# Altium schematic sheet ADS1299DRV.SchDoc
size A2; SheetNumber: 7; SheetTotal: 7
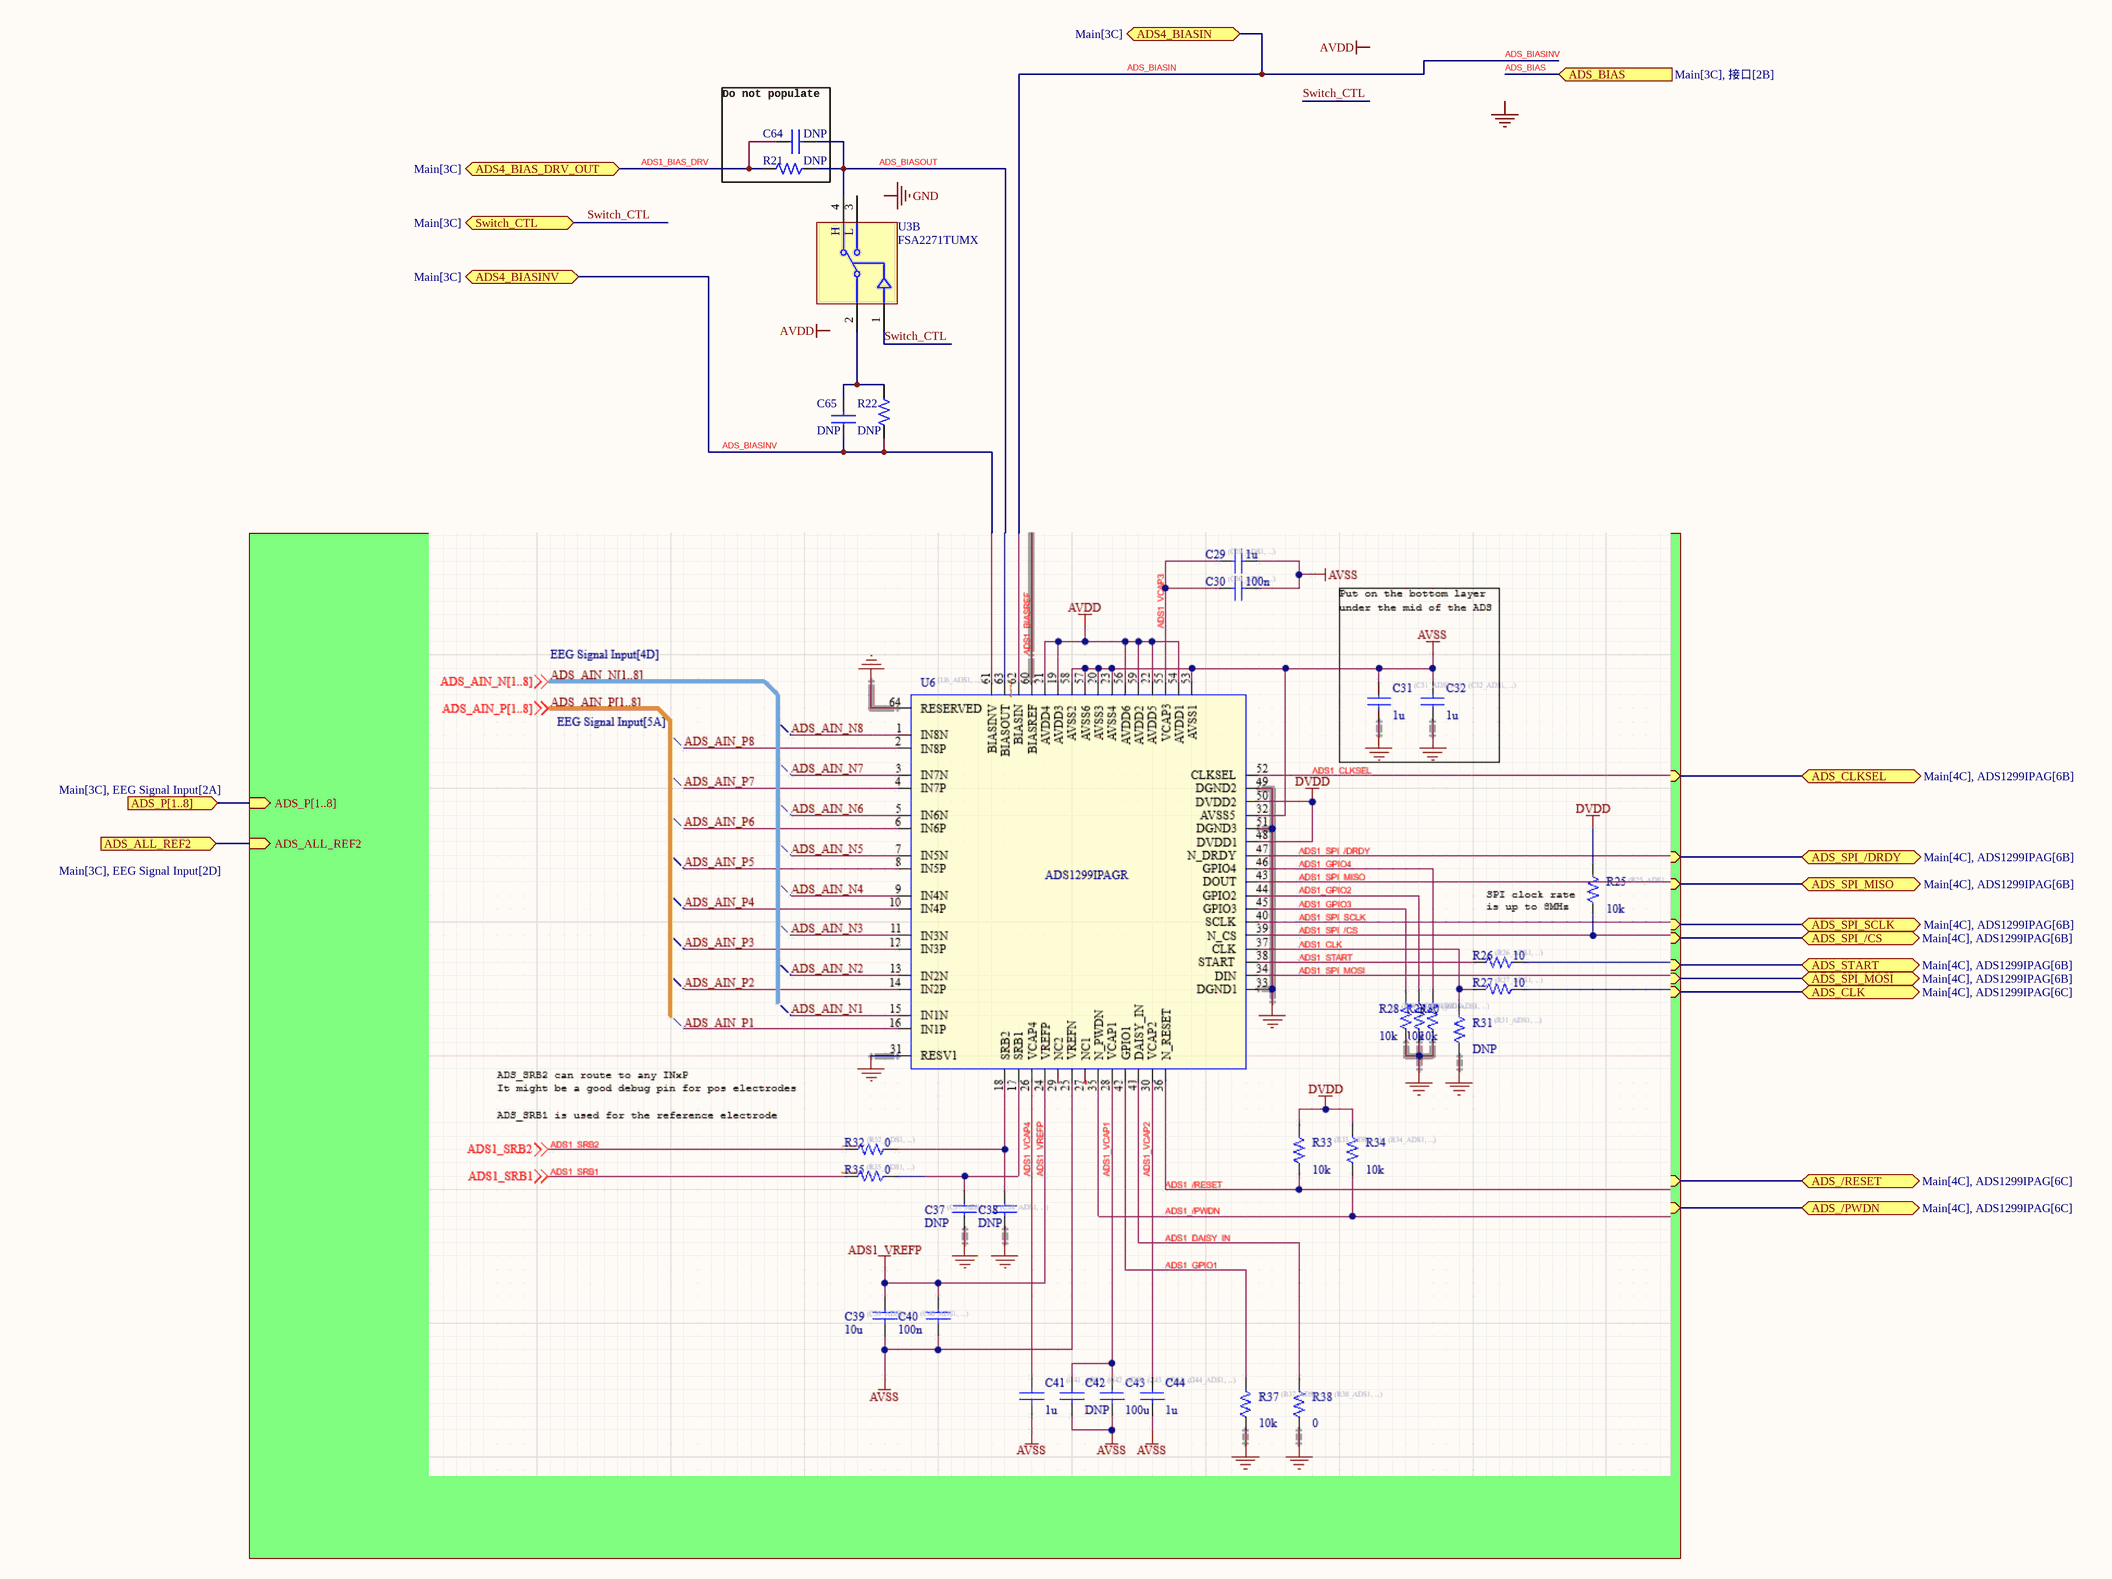
[diagram p0: ADS1299DRV.SchDoc]

## Parts
C64  DNP  [0402_C]
C65  DNP  [0402_C]
R21  DNP  [0402_R]
R22  DNP  [0402_R]
U3  FSA2271TUMX  [UFQFN-10(1.4x1.8)]  (part B of 2)

## Blocks framed on the sheet
Do not populate: C64 R21

## Sub-sheets
ADS4 = ADS1299IPAG.SchDoc;EEG Signal Input.SchDoc: ADS_P[1..8] (in), ADS_SPI_MOSI (bidir), ADS_SPI_/CS (bidir), ADS_SPI_SCLK (bidir), ADS_SPI_MISO (bidir), ADS_ALL_REF2 (in), ADS_BIASINV (bidir), ADS_START (bidir), ADS_CLK (bidir), ADS_SPI_/DRDY (bidir), ADS_/RESET (bidir), ADS_/PWDN (bidir), ADS_BIASIN (bidir), ADS_CLKSEL (bidir), ADS_BIASOUT (bidir)

## Ports
ADS4_BIAS_DRV_OUT (bidir, see Main[3C]), ADS4_BIASIN (bidir, see Main[3C]), ADS4_BIASINV (bidir, see Main[3C]), ADS_/PWDN (bidir, see Main[4C], ADS1299IPAG[6C]), ADS_/RESET (bidir, see Main[4C], ADS1299IPAG[6C]), ADS_ALL_REF2 (in, see Main[3C], EEG Signal Input[2D]), ADS_BIAS (in, see Main[3C], 接口[2B]), ADS_CLK (bidir, see Main[4C], ADS1299IPAG[6C]), ADS_CLKSEL (bidir, see Main[4C], ADS1299IPAG[6B]), ADS_P[1..8] (in, see Main[3C], EEG Signal Input[2A]), ADS_SPI_/CS (bidir, see Main[4C], ADS1299IPAG[6B]), ADS_SPI_/DRDY (bidir, see Main[4C], ADS1299IPAG[6B]), ADS_SPI_MISO (bidir, see Main[4C], ADS1299IPAG[6B]), ADS_SPI_MOSI (bidir, see Main[4C], ADS1299IPAG[6B]), ADS_SPI_SCLK (bidir, see Main[4C], ADS1299IPAG[6B]), ADS_START (bidir, see Main[4C], ADS1299IPAG[6B]), Switch_CTL (bidir, see Main[3C])

## Nets
ADS1_BIAS_DRV: C64.1 R21.2 ; port ADS4_BIAS_DRV_OUT
ADS_/PWDN: port ADS_/PWDN, sheet ADS4/ADS_/PWDN
ADS_/RESET: port ADS_/RESET, sheet ADS4/ADS_/RESET
ADS_ALL_REF2: port ADS_ALL_REF2, sheet ADS4/ADS_ALL_REF2
ADS_BIAS: port ADS_BIAS
ADS_BIASIN: C65.1 R22.2 ; port ADS4_BIASINV, port ADS4_BIASIN, sheet ADS4/ADS_BIASINV, sheet ADS4/ADS_BIASIN  [also labelled ADS_BIASINV]
ADS_BIASOUT: C64.2 R21.1 U3.4(2B1) ; sheet ADS4/ADS_BIASOUT
ADS_CLK: port ADS_CLK, sheet ADS4/ADS_CLK
ADS_CLKSEL: port ADS_CLKSEL, sheet ADS4/ADS_CLKSEL
ADS_SPI_/CS: port ADS_SPI_/CS, sheet ADS4/ADS_SPI_/CS
ADS_SPI_/DRDY: port ADS_SPI_/DRDY, sheet ADS4/ADS_SPI_/DRDY
ADS_SPI_MISO: port ADS_SPI_MISO, sheet ADS4/ADS_SPI_MISO
ADS_SPI_MOSI: port ADS_SPI_MOSI, sheet ADS4/ADS_SPI_MOSI
ADS_SPI_SCLK: port ADS_SPI_SCLK, sheet ADS4/ADS_SPI_SCLK
ADS_START: port ADS_START, sheet ADS4/ADS_START
Switch_CTL: U3.1(S2) ; port Switch_CTL
NetC65_2: C65.2 R22.1 U3.2(2A)

Not connected (* = marked no-connect by the designer): U3 3(2B0)

## Buses and harness runs
bus port ADS_P[1..8] = sheet ADS4/ADS_P[1..8]

## Notes on the sheet
- Labels drawn without touching a wire or pin: AVDD, GND
- (in symbol FSA2271TUMX, part B) H; L

## Library data of the parts
C64 C65 = CAP0402: FPLIST: 0402_smd; PCB Footprint: C0402
R21 R22 = RES: PCB Footprint: R0402